# Altium schematic sheet rpi_ERC.SchDoc
size A4; SheetNumber: 1; SheetTotal: 1
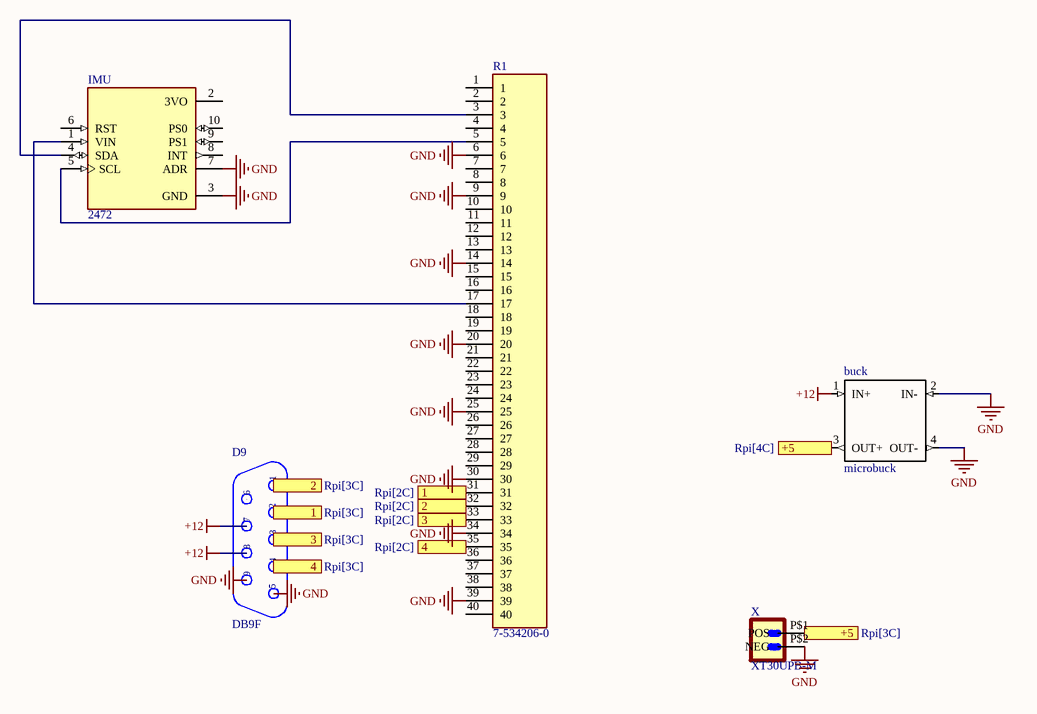
[diagram p0: rpi_ERC.SchDoc]

## Parts
buck  microbuck  [Micro buck]
D9  DB9F  [D-09F]
IMU  2472  [MODULE_2472]
R1  7-534206-0  [TE_7-534206-0]
X  XT30UPB-M  [XT30UPB-M]

## Ports
1 (see Rpi[2C]), 1 (see Rpi[3C]), 2 (see Rpi[2C]), 2 (see Rpi[3C]), 3 (see Rpi[2C]), 3 (see Rpi[3C]), 4 (see Rpi[2C]), 4 (see Rpi[3C]), +5 (see Rpi[3C]), +5 (see Rpi[4C])

## Nets
+12: buck.1(IN+) D9.7 D9.8
GND: buck.2(IN-) buck.4(OUT-) D9.5 D9.9 IMU.3(GND) IMU.7(ADR) R1.6 R1.9 R1.14 R1.20 R1.25 R1.30 R1.34 R1.39 X.P$2(NEG)
1: D9.2 R1.31 ; port 1
2: D9.1 R1.32 ; port 2
3: D9.3 R1.33 ; port 3
4: D9.4 R1.35 ; port 4
+5: buck.3(OUT+) X.P$1(POS) ; port +5
NetIMU_1: IMU.1(VIN) R1.17
NetIMU_4: IMU.4(SDA) R1.3
NetIMU_5: IMU.5(SCL) R1.5

Not connected (* = marked no-connect by the designer): D9 6; IMU 2(3VO) 6(RST) 8(INT) 9(PS1) 10(PS0); R1 1 2 4 7 8 10 11 12 13 15 16 18 19 21 22 23 24 26 27 28 29 36 37 38 40

## Library data of the parts
D9 = DB9F: Adapter Connector D-Sub, 9 Pin Female To Modular, Female Jack, 8p8c _RJ45_ Beige; MF: Assmann WSW; SnapEDA_Link: https://www.snapeda.com/parts/DB9F/Assmann%20WSW%20Components/view-part/558712/?ref=snap; MP: DB9F; Availability: Unavailable; Price: None; Value: *; Package: None
IMU = 2472: Adafruit 9-DOF Absolute Orientation IMU Fusion Breakout - BNO055 | Adafruit Industries 2472; SnapEDA_Link: https://www.snapeda.com/parts/2472/Adafruit+Industries/view-part/?ref=snap; Package: Non-Standard Adafruit; Value: *; MF: Adafruit; MP: 2472; Check_prices: https://www.snapeda.com/parts/2472/Adafruit+Industries/view-part/?ref=eda
R1 = 7-534206-0: Connector Socket Strip Receptacle 40 Position 2.54mm Solder Straight Through Hole Gang Of Tubes; Centerline_Pitch: 2.54 mm[.1 in]; Number_of_Positions: 40; MF: TE Connectivity; EU_RoHS_Compliance: Compliant; Availability: Unavailable; MP: 7-534206-0; Product_Type: Connector; Price: None; TE_purchase_URL: https://www.te.com/usa-en/product-7-534206-0.html?te_bu=Cor&te_type=disp&te_campaign=seda_glo_cor-seda-global-disp-prtnr-fy19-seda-model-bom-cta_sma-317_1&elqCampaignId=32493; Value: *; SnapEDA_Link: https://www.snapeda.com/parts/7-534206-0/TE%20Connectivity%20AMP%20Connectors/view-part/1924012/?ref=snap; Package: None
X = XT30UPB-M: Socket; DC supply; XT30; male; PIN: 2; on PCBs; THT; yellow; 15A; 500V; MF: amass; MP: XT30UPB-M; Value: *; SnapEDA_Link: https://www.snapeda.com/parts/XT30UPB-M/AMASS/view-part/?ref=snap; Price: None; Package: None; Check_prices: https://www.snapeda.com/parts/XT30UPB-M/AMASS/view-part/?ref=eda; Availability: Not in stock